# EAGLE design xbee_carrier (EAGLE 6.2)
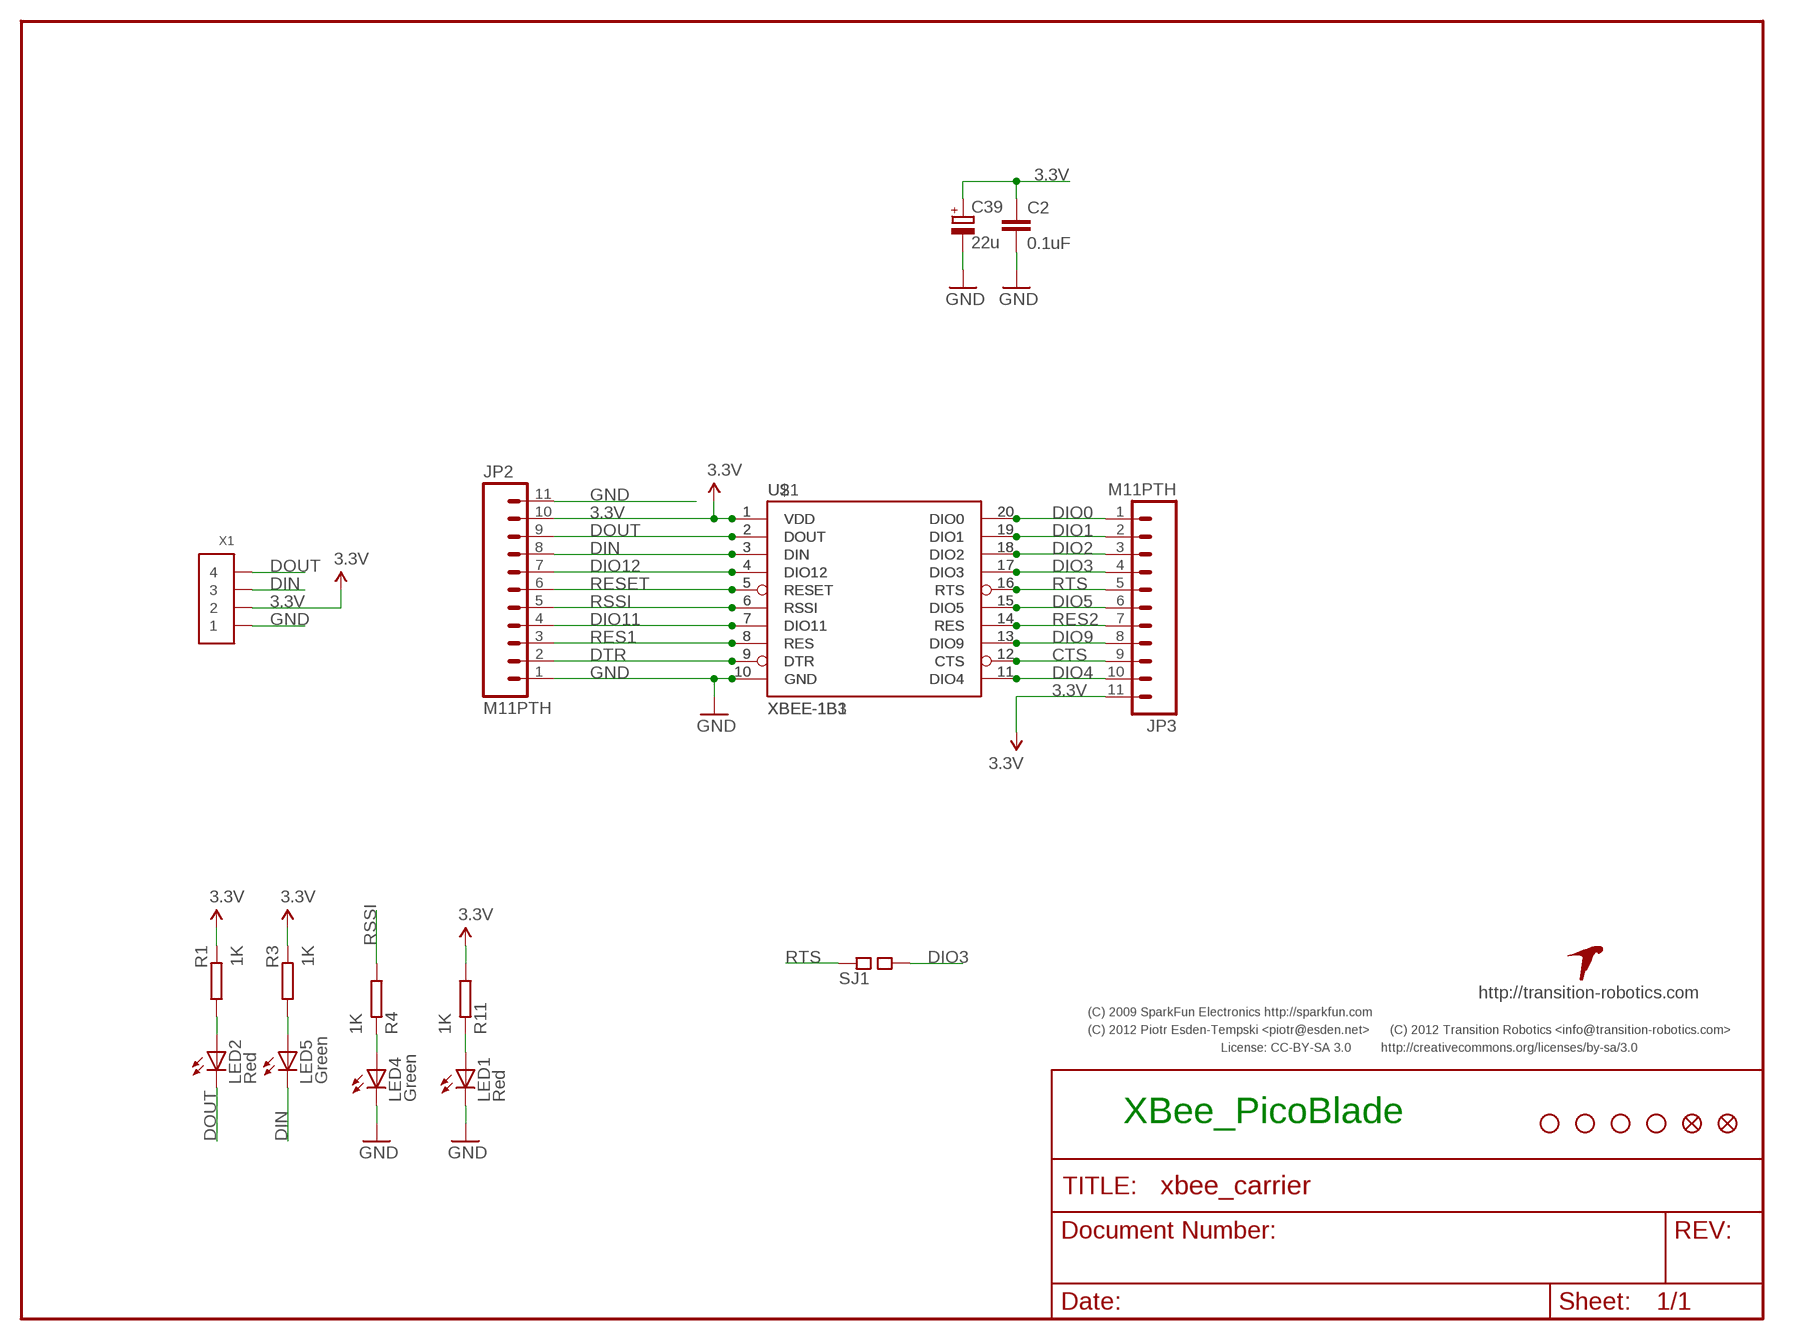
[diagram p0: schematic, sheet 1]

## Parts
C2  0.1uF  CAPACITOR-0402  [0402-CAP]
C39  22u  CAPACITOR-POLB  [3528/B]
JP2  M11PTH  [1X11]
JP3  M11PTH  [1X11]
LED1  Red  LED-0402  [0402-LED]
LED2  Red  LED-0402  [0402-LED]
LED4  Green  LED-0402  [0402-LED]
LED5  Green  LED-0402  [0402-LED]
R1  1K  RESISTOR-0402  [0402-RES]
R3  1K  RESISTOR-0402  [0402-RES]
R4  1K  RESISTOR-0402  [0402-RES]
R11  1K  RESISTOR-0402  [0402-RES]
SJ1  SQ_JMP-0402  [0402-SQJMP]
U2  XBEE-1B3  [XBEE-SMD]
U$1  XBEE-1B1  [XBEE-1]
U$2  TR-LOGO  [TR-LOGO]
U$5  STAND-OFF  [STAND-OFF]
U$7  FIDUCIAL1X2  [FIDUCIAL-1X2]
U$9  STAND-OFF  [STAND-OFF]
U$10  STAND-OFF  [STAND-OFF]
U$11  STAND-OFF  [STAND-OFF]
U$16  FIDUCIAL1X2  [FIDUCIAL-1X2]
X1  CONN_4-1-53261  [PB-53261-04]

## Nets
3.3V [vcc]: C2.P$1 C39.+ JP2.10 JP3.11 R1.P$1 R3.P$1 R11.P$2 U2.1(VDD) U$1.1(VDD) X1.2
CTS: JP3.9 U2.12(CTS) U$1.12(CTS)
DIN: JP2.8 LED5.C U2.3(DIN) U$1.3(DIN) X1.3
DIO0: JP3.1 U2.20(DIO0) U$1.20(DIO0)
DIO1: JP3.2 U2.19(DIO1) U$1.19(DIO1)
DIO2: JP3.3 U2.18(DIO2) U$1.18(DIO2)
DIO3: JP3.4 SJ1.P$2 U2.17(DIO3) U$1.17(DIO3)
DIO4: JP3.10 U2.11(DIO4) U$1.11(DIO4)
DIO5: JP3.6 U2.15(DIO5) U$1.15(DIO5)
DIO9: JP3.8 U2.13(DIO9) U$1.13(DIO9)
DIO11: JP2.4 U2.7(DIO11) U$1.7(DIO11)
DIO12: JP2.7 U2.4(DIO12) U$1.4(DIO12)
DOUT: JP2.9 LED2.C U2.2(DOUT) U$1.2(DOUT) X1.4
DTR: JP2.2 U2.9(DTR) U$1.9(DTR)
GND [vcc]: C2.P$2 C39.- JP2.1 JP2.11 LED1.C LED4.C U2.10(GND) U$1.10(GND) X1.1
N$1: LED2.A R1.P$2
N$2: LED4.A R4.P$1
N$4: LED5.A R3.P$2
N$38: LED1.A R11.P$1
RES1: JP2.3 U2.8(RES) U$1.8(RES)
RES2: JP3.7 U2.14(RES) U$1.14(RES)
RESET: JP2.6 U2.5(RESET) U$1.5(RESET)
RSSI: JP2.5 R4.P$2 U2.6(RSSI) U$1.6(RSSI)
RTS: JP3.5 SJ1.P$1 U2.16(RTS) U$1.16(RTS)

## Notes on the sheet
- http://transition-robotics.com
- (C) 2009 SparkFun Electronics http://sparkfun.com
- (C) 2012 Piotr Esden-Tempski <piotr@esden.net> | (C) 2012 Transition Robotics <info@transition-robotics.com>
- License: CC-BY-SA 3.0 | http://creativecommons.org/licenses/by-sa/3.0
- XBee_PicoBlade

## Library data of the parts
C2 = pel_dipol_comp:CAPACITOR; PARTNO: cap-cer-0402-100n
C39 = pel_dipol_comp:CAPACITOR-POL; PARTNO: cap-tan-B-22u-16v
JP2 JP3 = SparkFun:M11: Header 11 Standard 11-pin 0.1" header. Use with straight break away headers (SKU : PRT-00116), right angle break away headers (PRT-00553), swiss pins (PRT-00743), machine pins (PRT-00117), and female headers (PRT-00115).; PARTNO: *
LED1 LED2 = pel_dipol_comp:LED; PARTNO: led-0402-red
LED4 LED5 = pel_dipol_comp:LED; PARTNO: led-0402-green
R1 R3 R4 R11 = pel_dipol_comp:RESISTOR; PARTNO: res-0402-1k5
SJ1 = pel_jumpers:SQ_JMP; PARTNO: *
U2 = SparkFun:XBEE-1; PARTNO: *
U$1 = SparkFun-RF:XBEE-1: Xbee module footprints; PARTNO: *
U$2 = quadshot:TR-LOGO; BOM: EXCLUDE; PARTNO: *
U$5 U$9-U$11 = SparkFun:STAND-OFF: Stand Off This is the mechanical footprint for a #4 phillips button head screw. Use the keepout ring to avoid running the screw head into surrounding components. SKU : PRT-00447; PARTNO: *
U$7 U$16 = SparkFun:FIDUCIAL: Fiducial Alignment Points Various fiducial points for machine vision alignment.; PARTNO: *
X1 = pel_molex:CONN_4-1; PARTNO: conn-picoblade-smd-0.05in-4

## Net classes
0 default: width 0.203 mm
1 vcc: width 0.305 mm
2 gnd: width 0.254 mm

## Board
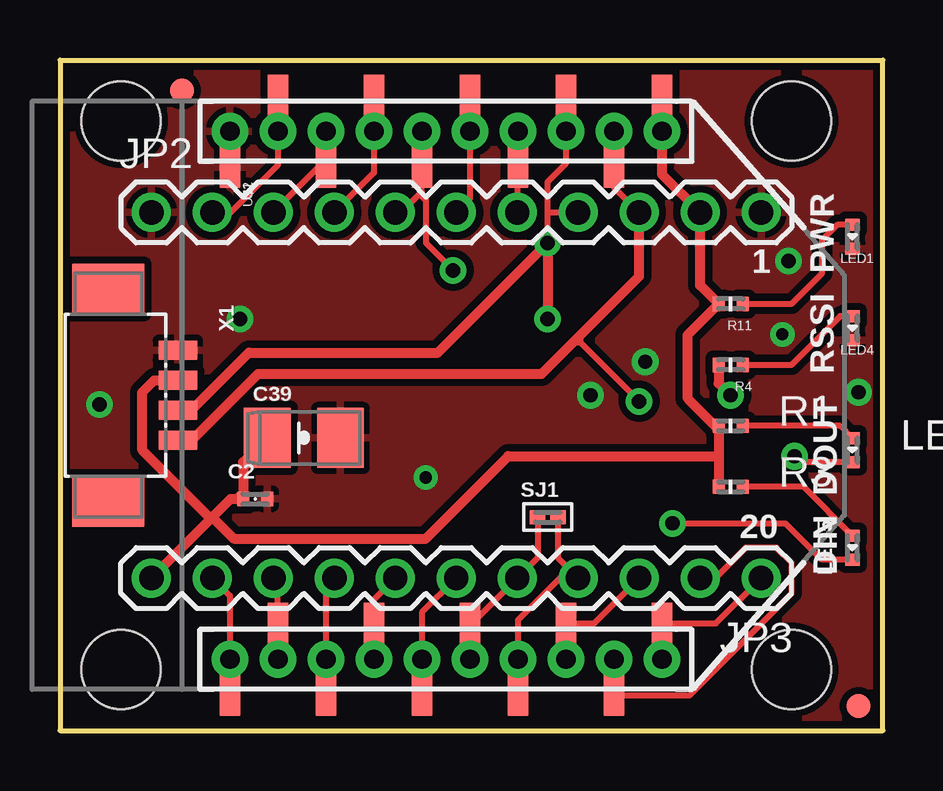
[diagram p1: board, top side]
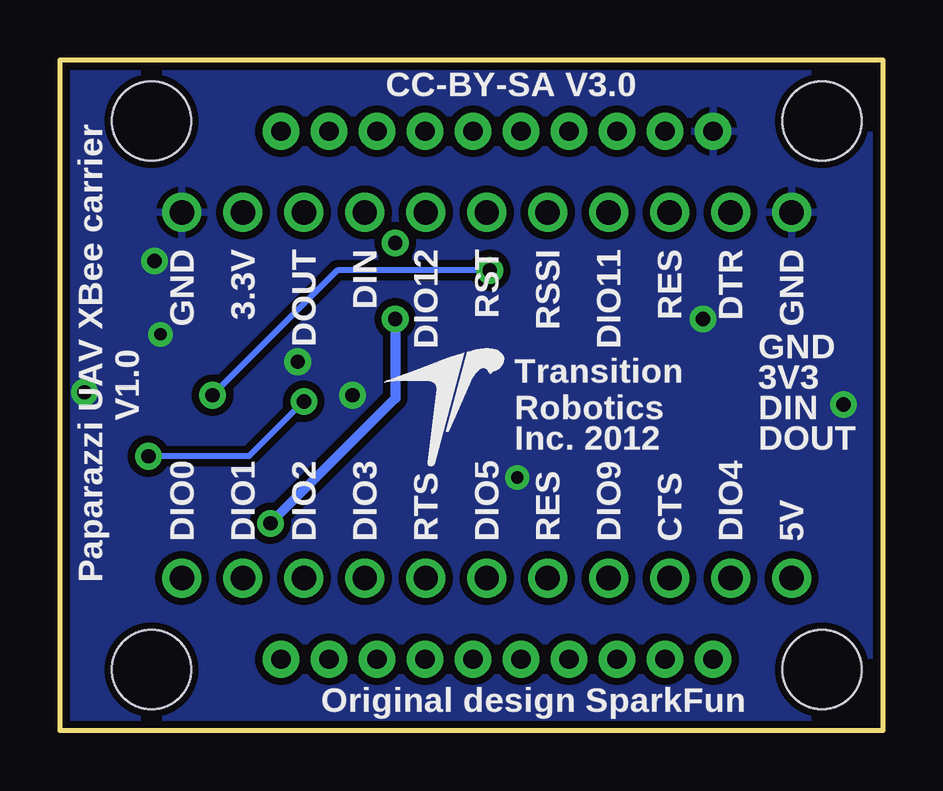
[diagram p2: board, bottom side, seen from below]

Size 34.29 x 27.94 mm. Coordinates in mm from the lower left corner, seen from the top.
Outline: 34.29,0 34.29,27.94 0,27.94 0,0 34.29,0
Copper layers (1*16): Top 0.035mm / dielectric 1.5mm / Bottom 0.035mm
Design rules: minimum track width 8mil, minimum drill 20mil, track to track 8mil, track to pad 8mil, pad to pad 8mil, via to via 8mil, smd to smd 8mil, copper to edge 10mil, drill to drill 8mil, minimum pad ring 12mil, minimum via ring 10mil, stop-mask expansion 3mil, vias tented up to drill 0.6mm, thermal gap 10mil

### Footprints (pad centres in the part's own frame; a part is rotated, then mirrored left to right if it is on the bottom)
0402-CAP = smd 0.5 x 0.6: P$1 -0.5,0; P$2 0.5,0
3528/B = smd 1.95 x 2.5: + -1.525,0; - 1.525,0
1X11 = drill 1.016: 1 0,0; 2 2.54,0; 3 5.08,0; 4 7.62,0; 5 10.16,0; 6 12.7,0; 7 15.24,0; 8 17.78,0; 9 20.32,0; 10 22.86,0; 11 25.4,0
0402-LED = smd 0.5 x 0.6: A 0.5,0; C -0.5,0
0402-RES = smd 0.5 x 0.6: P$1 -0.5,0; P$2 0.5,0
0402-SQJMP = smd 0.652 x 0.6: P$1 -0.424,0; P$2 0.424,0
XBEE-SMD = smd 1.7 x 0.85: 1 -12.5,20; 2 -9.5,18; 3 -12.5,16; 4 -9.5,14; 5 -12.5,12; 6 -9.5,10; 7 -12.5,8; 8 -9.5,6; 9 -12.5,4; 10 -9.5,2; 11 12.5,2; 12 9.5,4; 13 12.5,6; 14 9.5,8; 15 12.5,10; 16 9.5,12; 17 12.5,14; 18 9.5,16; 19 12.5,18; 20 9.5,20
XBEE-1 = drill 0.8 pad 1.524: 1 -11,20; 2 -11,18; 3 -11,16; 4 -11,14; 5 -11,12; 6 -11,10; 7 -11,8; 8 -11,6; 9 -11,4; 10 -11,2; 11 11,2; 12 11,4; 13 11,6; 14 11,8; 15 11,10; 16 11,12; 17 11,14; 18 11,16; 19 11,18; 20 11,20
STAND-OFF = hole 3.302: 0,0
FIDUCIAL-1X2 = smd 1 x 1: 1 0,0
PB-53261-04 = smd 0.8 x 1.6: 1 -1.875,1.1; 2 -0.625,1.1; 3 0.625,1.1; 4 1.875,1.1 | smd 2.1 x 3: MNT1 -4.425,-1.8; MNT2 4.425,-1.8

### Placement (x,y rotation side)
C2  8.13,9.65 0 top
C39  10.16,12.19 0 top
JP2  3.81,21.59 0 top
JP3  29.21,6.35 180 top
LED1  33.02,20.57 90 top
LED2  33.02,11.68 90 top
LED4  33.02,16.76 90 top
LED5  33.02,7.62 90 top
R1  27.94,12.7 0 top
R3  27.94,10.16 0 top
R4  27.94,15.24 180 top
R11  27.94,17.78 180 top
SJ1  20.32,8.89 0 top
U2  5.08,13.97 270 top
U$1  5.08,13.97 270 top
U$2  18.29,13.46 0 bottom
U$5  2.54,2.54 0 top
U$7  33.27,1.02 0 top
U$9  2.54,25.4 0 top
U$10  30.48,25.4 0 top
U$11  30.48,2.54 0 top
U$16  5.08,26.67 0 top
X1  3.81,13.97 270 top

### Tracks (layer width: path | path; a pad name or v marks a point on that pad's centre or on a via)
3.3V
  Top 0.406: C2.P$1 7.11,9.65 6.35,8.89 | C2.P$1 7.63,11.19 C39.+ | JP3.11 6.29,8.83 | 6.29,8.83 6.35,8.89 | X1.2 3.93,14.6 3.43,14.1 3.43,11.68 6.29,8.83 | 6.35,8.89 7.24,8 15.24,8 18.67,11.43 27.44,11.43 | U2.1 U$1.1 25.08,23.18 JP2.10 26.67,18.55 R11.P$2 26.17,16.51 26.16,16.51 26.16,13.83 27.29,12.7 R1.P$1 27.44,11.43 | 7.49,9.78 C2.P$1 | 27.44,11.43 R3.P$1
CTS
  Top 0.254: JP3.9 9.08,6.16 U2.12 U$1.12
DIN  (via drill 0.6)
  Top 0.254: v20.32,20.32 20.32,21.59 | 20.32,21.59 20.32,22.86 21.08,23.62 U$1.3 U2.3 | 20.32,21.59 JP2.8 | v25.53,8.64 30.23,8.64 31.74,7.12 LED5.C
  Top 0.406: X1.3 5.47,13.35 7.87,15.75 15.75,15.75 v20.32,20.32 v20.32,17.14
  Bottom 0.406: v25.53,8.64 20.32,13.84 v20.32,17.14
DIO0
  Top 0.254: JP3.1 27.33,4.47 U2.20 U$1.20
DIO1
  Top 0.254: JP3.2 27.3,6.35 28.57,7.62 29.84,7.62 30.48,6.99 30.48,5.71 26.23,1.47 U2.19 U$1.19
DIO2
  Top 0.254: JP3.3 22.25,4.47 U2.18 U$1.18
DIO3
  Top 0.254: U2.17 U$1.17 19.08,4.6 20.83,6.35 JP3.4 20.74,7.2 SJ1.P$2
DIO4
  Top 0.254: JP3.10 7.08,5.62 U$1.11 U2.11
DIO5
  Top 0.254: JP3.6 15.08,4.92 U$1.15 U2.15
DIO9
  Top 0.254: JP3.8 11.08,6 U$1.13 U2.13
DIO11
  Top 0.254: JP2.4 13.08,23.24 U$1.7 U2.7
DIO12
  Top 0.254: JP2.7 19.08,21.62 U2.4 U$1.4
DOUT  (via drill 0.6)
  Top 0.254: JP2.9 23.08,22.64 U2.2 U$1.2 | 21.59,16.26 v24.13,13.72 | LED2.C 30.85,11.18 v30.61,11.43
  Top 0.406: X1.4 5.49,12.1 8.26,14.86 20.07,14.86 21.59,16.38 | JP2.9 24.13,18.92 21.59,16.38 | 21.59,16.38 21.59,16.26
  Bottom 0.254: v24.13,13.72 26.42,11.43 v30.61,11.43
DTR
  Top 0.254: JP2.2 7.11,21.59 9.08,23.56 U$1.9 U2.9
GND  (via drill 0.51, 0.6)
  other vias: 15.24,10.54 30.1,16.51 33.27,14.1 7.49,17.14 1.65,13.59 24.38,15.37 22.1,13.97 30.35,19.56
  pour Bottom (isolate 0.305): 0,27.94 34.29,27.94 34.29,0 0,0
  pour Top (isolate 0.305): 0,27.94 34.29,27.94 34.29,0 0,0
N$1
  Top 0.254: LED2.A 32.5,12.7 R1.P$2
N$2
  Top 0.254: R4.P$1 30.48,15.24 32.5,17.26 LED4.A
N$4
  Top 0.254: LED5.A 30.98,10.16 R3.P$2
N$38
  Top 0.254: R11.P$1 30.48,17.78 31.75,19.05 31.75,20.45 32.38,21.07 LED1.A
RES1
  Top 0.254: JP2.3 10.77,23.47 U2.8 U$1.8
RES2
  Top 0.254: JP3.7 13.08,5.46 U2.14 U$1.14
RESET
  Top 0.254: JP2.6 17.08,22.16 U$1.5 U2.5
RSSI  (via drill 0.6)
  Top 0.254: JP2.5 14.22,21.59 15.08,22.45 | 15.08,22.45 U2.6 U$1.6 | 15.08,22.45 15.08,22.26 15.24,22.1 15.24,20.32 v16.38,19.18
  Top 0.406: R4.P$2 27.44,14.47 v27.94,13.97
  Bottom 0.254: v16.38,19.18 22.73,19.18 v27.94,13.97
RTS
  Top 0.254: U$1.16 U2.16 17.17,4.47 JP3.5 19.9,7.2 SJ1.P$1

### Text on the board
tPlace: 1 | PWR | RSSI | DOUT | 20 | DIN
bPlace: CC-BY-SA V3.0 | Paparazzi UAV XBee carrier | GND | DTR | RES | DIO11 | RSSI | RST | DIO12 | DIN | DOUT | 3.3V | GND | V1.0 | GND | 3V3 | Transition | DIN | Robotics | DOUT | Inc. 2012 | 5V | DIO4 | CTS | DIO9 | RES | DIO5 | RTS | DIO3 | DIO2 | DIO1 | DIO0 | Original design SparkFun
tValues: XBee Socket Up | DNP | DNP | XBee Socket Up